# Altium schematic sheet MISC.SchDoc
size A4
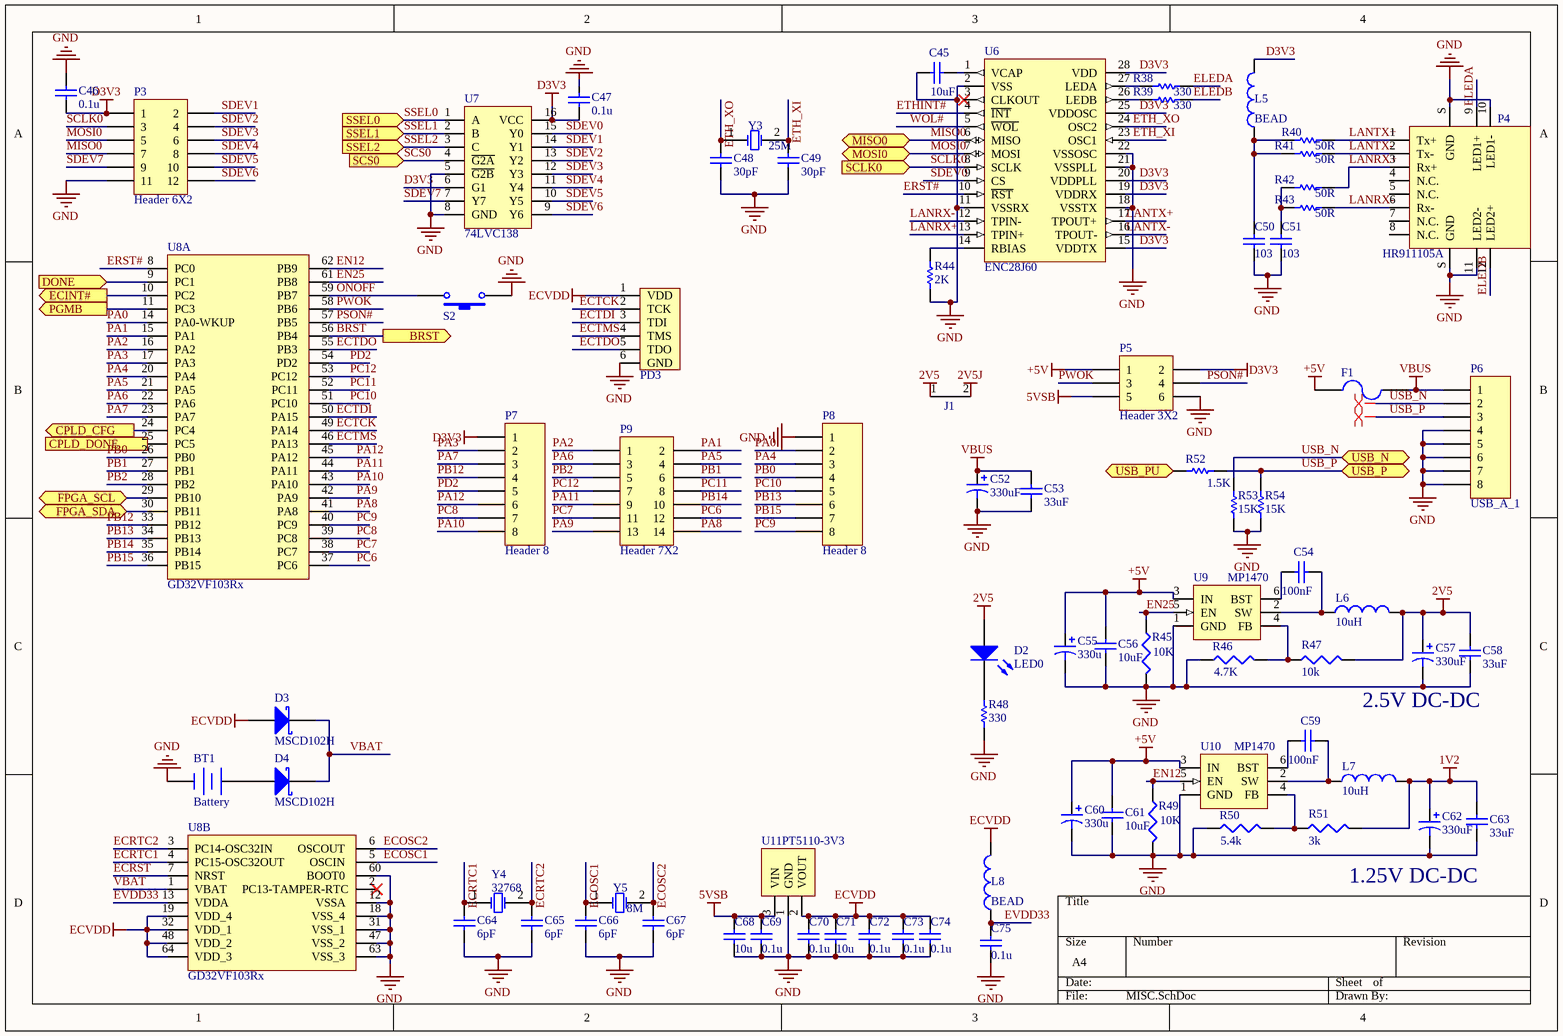
[diagram p0: MISC.SchDoc]

## Parts
BT1  Battery  [BAT-CR1220]
C45  value 10uF  [0603C]  (hidden comment: Cap)
C46  value 0.1u  [0603C]  (hidden comment: Cap)
C47  value 0.1u  [0603C]  (hidden comment: Cap)
C48  value 30pF  [0603C]  (hidden comment: Cap)
C49  value 30pF  [0603C]  (hidden comment: Cap)
C50  value 103  [0603C]  (hidden comment: Cap)
C51  value 103  [0603C]  (hidden comment: Cap)
C52  value 330uF  [TanCap-1210]  (hidden comment: 330u)
C53  value 33uF  [0603C]  (hidden comment: 106)
C54  value 100nF  [0603C]  (hidden comment: 104)
C55  330u  [TanCap-1210]
C56  value 10uF  [0603C]  (hidden comment: 106)
C57  value 330uF  [TanCap-1210]  (hidden comment: 330u)
C58  value 33uF  [0603C]  (hidden comment: 106)
C59  value 100nF  [0603C]  (hidden comment: 104)
C60  330u  [TanCap-1210]
C61  value 10uF  [0603C]  (hidden comment: 106)
C62  value 330uF  [TanCap-1210]  (hidden comment: 330u)
C63  value 33uF  [0603C]  (hidden comment: 106)
C64  value 6pF  [0603C]  (hidden comment: Cap)
C65  value 6pF  [0603C]  (hidden comment: Cap)
C66  value 6pF  [0603C]  (hidden comment: Cap)
C67  value 6pF  [0603C]  (hidden comment: Cap)
C68  value 10u  [0603C]  (hidden comment: Cap)
C69  value 0.1u  [0603C]  (hidden comment: Cap)
C70  value 0.1u  [0603C]  (hidden comment: Cap)
C71  value 10u  [0603C]  (hidden comment: Cap)
C72  value 0.1u  [0603C]  (hidden comment: Cap)
C73  value 0.1u  [0603C]  (hidden comment: Cap)
C74  value 0.1u  [0603C]  (hidden comment: Cap)
C75  value 0.1u  [0603C]  (hidden comment: Cap)
D2  LED0  [0805LED1]
D3  MSCD102H  [0805LED2]
D4  MSCD102H  [0805LED2]
F1  Fuse 2  [Fusebux_5x20]  (value not drawn)
J1  Jumper  [Jumper 10mm]  (value not drawn)
L5  value BEAD  [0603C]  (hidden comment: Inductor)
L6  10uH  [PIND0650]
L7  10uH  [PIND0650]
L8  value BEAD  [0603C]  (hidden comment: Inductor)
P3  Header 6X2  [HDR2X6]
P4  HR911105A  [HR911105A]
P5  Header 3X2  [PWRCONN-6P]
P6  USB_A_1  [USB-A_1]
P7  Header 8  [HDR1X8]
P8  Header 8  [HDR1X8]
P9  Header 7X2  [HDR2X7_U]
PD3  JTAG  [DBGP7]  (value not drawn)
R38  value 330  [0603R]  (hidden comment: Res1)
R39  value 330  [0603R]  (hidden comment: Res1)
R40  value 50R  [0603R]  (hidden comment: Res1)
R41  value 50R  [0603R]  (hidden comment: Res1)
R42  value 50R  [0603R]  (hidden comment: Res1)
R43  value 50R  [0603R]  (hidden comment: Res1)
R44  value 2K  [0603R]  (hidden comment: Res1)
R45  10K  [0603R]
R46  value 4.7K  [0603R]  (hidden comment: 3K2)
R47  10K  [0603R]
R48  value 330  [0603R]  (hidden comment: Res1)
R49  10K  [0603R]
R50  value 5.4k  [0603R]  (hidden comment: 3K2)
R51  value 3k  [0603R]  (hidden comment: 10K)
R52  value 1.5K  [0603R]  (hidden comment: Res1)
R53  value 15K  [0603R]  (hidden comment: Res1)
R54  value 15K  [0603R]  (hidden comment: Res1)
S2  SW-PB  [Switch_SMT-022S-H2.5]  (value not drawn)
U6  ENC28J60  [SOIC28P1040X265]
U7  74LVC138  [SO-16]
U8  GD32VF103Rx  [QFP12X12-64(N)]  (parts A,B of 2)
U9  MP1470  [SOT95P245X110-6N]
U10  MP1470  [SOT95P245X110-6N]
U11  PT5110-3V3  [SOT323-N]
Y3  25M  [XTAL-5032]
Y4  32768  [XTAL-3215]
Y5  8M  [XTAL-5032]

## Ports
BRST (out), CPLD_CFG (out), CPLD_DONE (in), DONE (in), ECINT# (out), FPGA_SCL (bidir), FPGA_SDA (bidir), MISO0 (bidir), MOSI0 (bidir), PGMB (out), SCLK0 (in), SCS0 (in), SSEL0 (in), SSEL1 (in), SSEL2 (in), USB_N (bidir), USB_P (bidir), USB_PU (bidir)

## Nets
1V2: C62.1 C63.2 L7.2 R51.2
2V5: C57.1 C58.2 D2.1(A) J1.1 L6.2 R47.2
2V5J: J1.2
5VSB: C68.2 C69.2 P5.5 U11.3(VIN)
+5V: C55.1 C56.2 C60.1 C61.2 F1.1 P5.1 U9.3(IN) U10.3(IN)
D3V3: C46.2 C47.2 L5.2 P3.1 P5.2 P7.1 U6.15(VDDTX) U6.19(VDDRX) U6.20(VDDPLL) U6.25(VDDOSC) U6.28(VDD) U7.6(G1) U7.16(VCC)
ECVDD: C70.2 C71.2 C72.2 C73.2 C74.2 D3.1(A) L8.2 PD3.1(VDD) U8.19(VDD_4) U8.32(VDD_1) U8.48(VDD_2) U8.64(VDD_3) U11.2(VOUT)
GND: BT1.2(-) C45.2 C46.1 C47.1 C48.2 C49.2 C50.1 C51.1 C52.2 C53.1 C55.2 C56.1 C57.2 C58.1 C60.2 C61.1 C62.2 C63.1 C64.2 C65.2 C66.2 C67.2 C68.1 C69.1 C70.1 C71.1 C72.1 C73.1 C74.1 C75.1 P3.11 P4.10(LED1-) P4.11(LED2-) P4.S(GND) P5.6 P6.4 P6.5 P6.6 P6.7 P6.8 P8.1 PD3.6(GND) R44.2 R45.2 R46.1 R48.2 R49.2 R50.1 R53.2 R54.2 S2.1 U6.2(VSS) U6.11(VSSRX) U6.18(VSSTX) U6.21(VSSPLL) U6.22(VSSOSC) U7.5(~{G2B}) U7.8(GND) U8.12(VSSA) U8.18(VSS_4) U8.31(VSS_1) U8.47(VSS_2) U8.60(BOOT0) U8.63(VSS_3) U9.1(GND) U10.1(GND) U11.1(GND)
VBUS: C52.1 C53.2 F1.2 P6.1
BRST: U8.56(PB4) ; port BRST
CPLD_CFG: U8.24(PC4) ; port CPLD_CFG
CPLD_DONE: U8.25(PC5) ; port CPLD_DONE
DONE: U8.9(PC1) ; port DONE
ECINT#: U8.10(PC2) ; port ECINT#
ECOSC1: C66.1 U8.5(OSCIN) Y5.1(OSC1)
ECOSC2: C67.1 U8.6(OSCOUT) Y5.2(OSC2)
ECRST: U8.7(NRST)
ECRTC1: C64.1 U8.4(PC15-OSC32OUT) Y4.1(OSC1)
ECRTC2: C65.1 U8.3(PC14-OSC32IN) Y4.2(OSC2)
ECTCK: PD3.2(TCK) U8.49(PA14)
ECTDI: PD3.3(TDI) U8.50(PA15)
ECTDO: PD3.5(TDO) U8.55(PB3)
ECTMS: PD3.4(TMS) U8.46(PA13)
ELEDA: P4.9(LED1+) R38.1
ELEDB: P4.12(LED2+) R39.1
EN12: R49.1 U8.62(PB9) U10.5(EN)
EN25: R45.1 U8.61(PB8) U9.5(EN)
ERST#: U6.10(~{RST}) U8.8(PC0)
ETH_XI: C49.1 U6.23(OSC1) Y3.2(OSC2)
ETH_XO: C48.1 U6.24(OSC2) Y3.1(OSC1)
ETHINT#: U6.4(~{INT})
EVDD33: C75.2 L8.1 U8.13(VDDA)
FPGA_SCL: U8.29(PB10) ; port FPGA_SCL
FPGA_SDA: U8.30(PB11) ; port FPGA_SDA
LANRX+: P4.3(Rx+) R42.1 U6.13(TPIN+)
LANRX-: P4.6(Rx-) R43.1 U6.12(TPIN-)
LANTX+: P4.1(Tx+) R40.1 U6.17(TPOUT+)
LANTX-: P4.2(Tx-) R41.1 U6.16(TPOUT-)
MISO0: P3.7 U6.6(MISO) ; port MISO0
MOSI0: P3.5 U6.7(MOSI) ; port MOSI0
ONOFF: S2.2 U8.59(PB7)
PA0: P8.2 U8.14(PA0-WKUP)
PA1: P9.2 U8.15(PA1)
PA2: P9.1 U8.16(PA2)
PA3: P7.2 U8.17(PA3)
PA4: P8.3 U8.20(PA4)
PA5: P9.4 U8.21(PA5)
PA6: P9.3 U8.22(PA6)
PA7: P7.3 U8.23(PA7)
PA8: P9.14 U8.41(PA8)
PA9: P9.13 U8.42(PA9)
PA10: P7.8 U8.43(PA10)
PA11: P9.9 U8.44(PA11)
PA12: P7.6 U8.45(PA12)
PB0: P8.4 U8.26(PB0)
PB1: P9.6 U8.27(PB1)
PB2: P9.5 U8.28(PB2)
PB12: P7.4 U8.33(PB12)
PB13: P8.6 U8.34(PB13)
PB14: P9.10 U8.35(PB14)
PB15: P8.7 U8.36(PB15)
PC6: P9.12 U8.37(PC6)
PC7: P9.11 U8.38(PC7)
PC8: P7.7 U8.39(PC8)
PC9: P8.8 U8.40(PC9)
PC10: P8.5 U8.51(PC10)
PC11: P9.8 U8.52(PC11)
PC12: P9.7 U8.53(PC12)
PD2: P7.5 U8.54(PD2)
PGMB: U8.11(PC3) ; port PGMB
PSON#: P5.4 U8.57(PB5)
PWOK: P5.3 U8.58(PB6)
SCLK0: P3.3 U6.8(SCLK) ; port SCLK0
SCS0: U7.4(~{G2A}) ; port SCS0
SDEV0: U6.9(CS) U7.15(Y0)
SDEV1: P3.2 U7.14(Y1)
SDEV2: P3.4 U7.13(Y2)
SDEV3: P3.6 U7.12(Y3)
SDEV4: P3.8 U7.11(Y4)
SDEV5: P3.10 U7.10(Y5)
SDEV6: P3.12 U7.9(Y6)
SDEV7: P3.9 U7.7(Y7)
SSEL0: U7.1(A) ; port SSEL0
SSEL1: U7.2(B) ; port SSEL1
SSEL2: U7.3(C) ; port SSEL2
USB_N: P6.2 R53.1 ; port USB_N
USB_P: P6.3 R52.2 R54.1 ; port USB_P
USB_PU: R52.1 ; port USB_PU
VBAT: D3.2(K) D4.2(K) U8.1(VBAT)
WOL#: U6.5(~{WOL})
NetBT1_1: BT1.1(+) D4.1(A)
NetC45_1: C45.1 U6.1(VCAP)
NetC50_2: C50.2 L5.1 R40.2 R41.2
NetC51_2: C51.2 R42.2 R43.2
NetC54_1: C54.1 L6.1 U9.2(SW)
NetC54_2: C54.2 U9.6(BST)
NetC59_1: C59.1 L7.1 U10.2(SW)
NetC59_2: C59.2 U10.6(BST)
NetD2_2: D2.2(K) R48.1
NetR38_2: R38.2 U6.27(LEDA)
NetR39_2: R39.2 U6.26(LEDB)
NetR44_1: R44.1 U6.14(RBIAS)
NetR46_2: R46.2 R47.1 U9.4(FB)
NetR50_2: R50.2 R51.1 U10.4(FB)

Not connected (* = marked no-connect by the designer): P4 4(N.C.) 5(N.C.) 7(N.C.) 8(N.C.); U6 3(CLKOUT)*; U8 2(PC13-TAMPER-RTC)*

## Layout directives
differential pair: USB_N, USB_P

## Notes on the sheet
- 2.5V DC-DC
- 1.25V DC-DC

## Library data of the parts
BT1 = Battery: Multicell Battery; Published: 24-Mar-1999; LatestRevisionDate: 17-Jul-2002; LatestRevisionNote: Re-released for DXP Platform.; PackageReference: BAT-2; Publisher: Altium Limited; PackageDescription: Battery; 2 Leads
C45-C51 C64-C75 = Cap: Capacitor; Published: 8-Jun-2000; LatestRevisionDate: 17-Jul-2002; LatestRevisionNote: Re-released for DXP Platform.; PackageReference: RAD-0.3; Publisher: Altium Limited; PackageDescription: Radial Cap, Thru-Hole; 2 Leads; 0.3 in Pin Spacing
C52 C55 C57 C60 C62 = Cap Pol1: Polarized Capacitor (Radial); Published: 8-Jun-2000; LatestRevisionDate: 17-Jul-2002; LatestRevisionNote: Re-released for DXP Platform.; PackageReference: RB7.6-15; Publisher: Altium Limited; PackageDescription: Polarized Capacitor (Radial); 2 Leads
  C55 C60: Value: 330u
C53 C54 C56 C58 C59 C61 C63 = Cap: Ceramic Capacitor 0603; Published: 8-Jun-2000; LatestRevisionDate: 17-Jul-2002; LatestRevisionNote: Re-released for DXP Platform.; PackageReference: RAD-0.3; Publisher: Altium Limited; PackageDescription: Radial Cap, Thru-Hole; 2 Leads; 0.3 in Pin Spacing
D2 = LED0: Typical INFRARED GaAs LED; Published: 8-Jun-2000; LatestRevisionDate: 08-Jul-2005; LatestRevisionNote: Mech Layer 1 removed.; PackageReference: LED-0; Publisher: Altium Limited; PackageDescription: LED; 2 Leads
D3 D4 = D Schottky: Schottky Diode; Published: 8-Jun-2000; LatestRevisionDate: 17-Jul-2002; LatestRevisionNote: Re-released for DXP Platform.; PackageReference: SMB; Publisher: Altium Limited; PackageDescription: DO-214-AA/SMB; 2 C-Bend Leads; Body 5.3 x 3.6 mm, inc. leads (LxW); Code_JEDEC: DO-214-AA
F1 = Fuse 2: Fuse; Published: 8-Jun-2000; LatestRevisionDate: 17-Jul-2002; LatestRevisionNote: Re-released for DXP Platform.; PackageReference: PIN-W2/E2.8; Publisher: Altium Limited; PackageDescription: Thru-Hole; 2 Leads
L5 L8 = Inductor: Code_IEC: 1005; Published: 8-Jun-2000; LatestRevisionDate: 29-May-2009; LatestRevisionNote: IPC-7351 Footprint Added.; PackageReference: 0402-A; Publisher: Altium Limited; PackageDescription: Chip Inductor; Code_JEITA: 0402
L6 L7 = Inductor: Inductor 0606; Code_IEC: 1005; Published: 8-Jun-2000; LatestRevisionDate: 29-May-2009; LatestRevisionNote: IPC-7351 Footprint Added.; PackageReference: 0402-A; Publisher: Altium Limited; PackageDescription: Chip Inductor; Code_JEITA: 0402; Value: 10uH
P3 = Header 6X2: Header, 6-Pin, Dual row; LatestRevisionDate: 17-Jul-2002; LatestRevisionNote: Re-released for DXP Platform.; Publisher: Altium Limited
P5 = Header 3X2: Header, 3-Pin, Dual row; LatestRevisionDate: 17-Jul-2002; LatestRevisionNote: Re-released for DXP Platform.; Publisher: Altium Limited
P6-P8 = Header 8: Header, 8-Pin; LatestRevisionDate: 17-Jul-2002; LatestRevisionNote: Re-released for DXP Platform.; Publisher: Altium Limited
P9 = Header 7X2: Header, 7-Pin, Dual row; LatestRevisionDate: 17-Jul-2002; LatestRevisionNote: Re-released for DXP Platform.; Publisher: Altium Limited
R38-R44 R48 R52-R54 = Res1: Resistor; Published: 8-Jun-2000; LatestRevisionDate: 17-Jul-2002; LatestRevisionNote: Re-released for DXP Platform.; PackageReference: AXIAL-0.3; Publisher: Altium Limited; PackageDescription: Axial Device, Thru-Hole; 2 Leads; 0.3 in Pin Spacing
R45-R47 R49-R51 = Res3: Resistor; Published: 8-Jun-2000; LatestRevisionDate: 29-May-2009; LatestRevisionNote: IPC-7351 Footprint Added.; PackageReference: J1-0603; Publisher: Altium Limited; PackageDescription: Chip Resistor
  R45 R49: Value: 10K
  R47: Value: 10k
S2 = SW-PB: Switch; Published: 24-Mar-1999; LatestRevisionDate: 17-Jul-2002; LatestRevisionNote: Re-released for DXP Platform.; PackageReference: SPST-2; Publisher: Altium Limited; PackageDescription: Switch; 2 Leads
U7 = 74x138
U11 = PT5110
Y3-Y5 = XTAL: Crystal Oscillator; Published: 8-Jun-2000; LatestRevisionDate: 17-Jul-2002; LatestRevisionNote: Re-released for DXP Platform.; PackageReference: R38; Publisher: Altium Limited; PackageDescription: Crystal, Thru-Hole; 2 Leads; Body 3.1 x 8.2 mm (Dia.xH)